# EAGLE design PIXIE_CHROMA_EVAL_PCB (EAGLE 9.5.1)
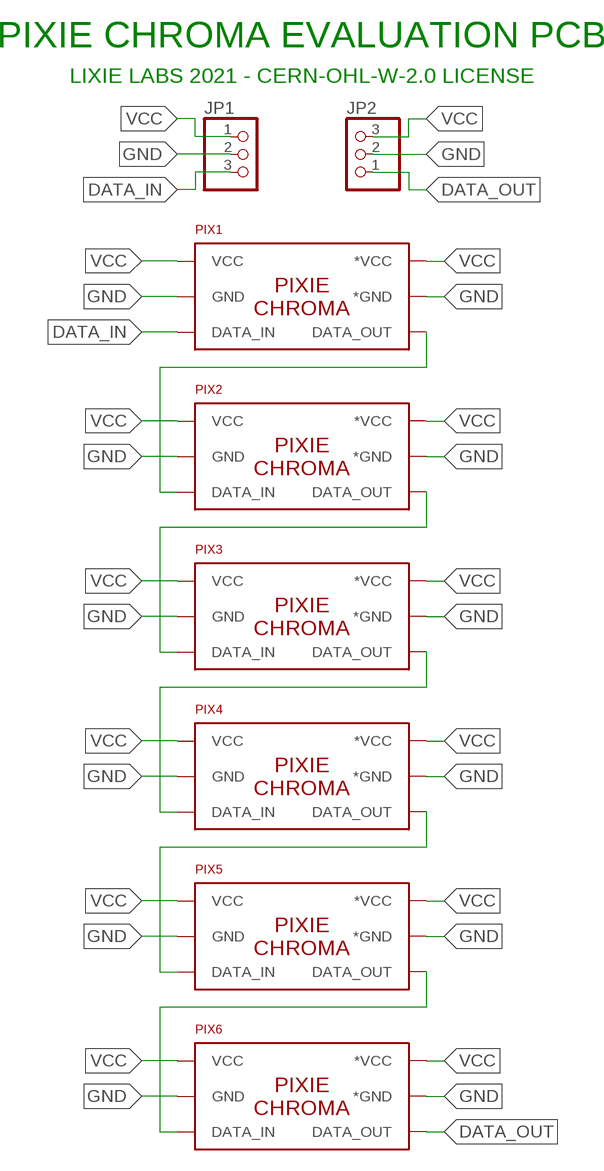
[diagram p0: schematic, sheet 1]

## Parts
JP1  PINHD-1X3  [1X03]
JP2  PINHD-1X3  [1X03]
PIX1  CHROMA  [CHROMA]
PIX2  CHROMA  [CHROMA]
PIX3  CHROMA  [CHROMA]
PIX4  CHROMA  [CHROMA]
PIX5  CHROMA  [CHROMA]
PIX6  CHROMA  [CHROMA]

## Nets
DATA_IN: JP1.3 PIX1.DATA_IN
DATA_OUT: JP2.1 PIX6.DATA_OUT
GND: JP1.2 JP2.2 PIX1.*GND PIX1.GND PIX2.*GND PIX2.GND PIX3.*GND PIX3.GND PIX4.*GND PIX4.GND PIX5.*GND PIX5.GND PIX6.*GND PIX6.GND
N$1: PIX1.DATA_OUT PIX2.DATA_IN
N$2: PIX2.DATA_OUT PIX3.DATA_IN
N$3: PIX3.DATA_OUT PIX4.DATA_IN
N$4: PIX4.DATA_OUT PIX5.DATA_IN
N$5: PIX5.DATA_OUT PIX6.DATA_IN
VCC: JP1.1 JP2.3 PIX1.*VCC PIX1.VCC PIX2.*VCC PIX2.VCC PIX3.*VCC PIX3.VCC PIX4.*VCC PIX4.VCC PIX5.*VCC PIX5.VCC PIX6.*VCC PIX6.VCC

## Notes on the sheet
- PIXIE CHROMA EVALUATION PCB
- LIXIE LABS 2021 - CERN-OHL-W-2.0 LICENSE

## Library data of the parts
JP1 JP2 = pinhead:PINHD-1X3: PIN HEADER
PIX1-PIX6 = PixieChroma:CHROMA: PIXIE CHROMA (R1) by LIXIE LABS (c) 2021 - CERN-OHL-W-2.0 LICENSE

## Board
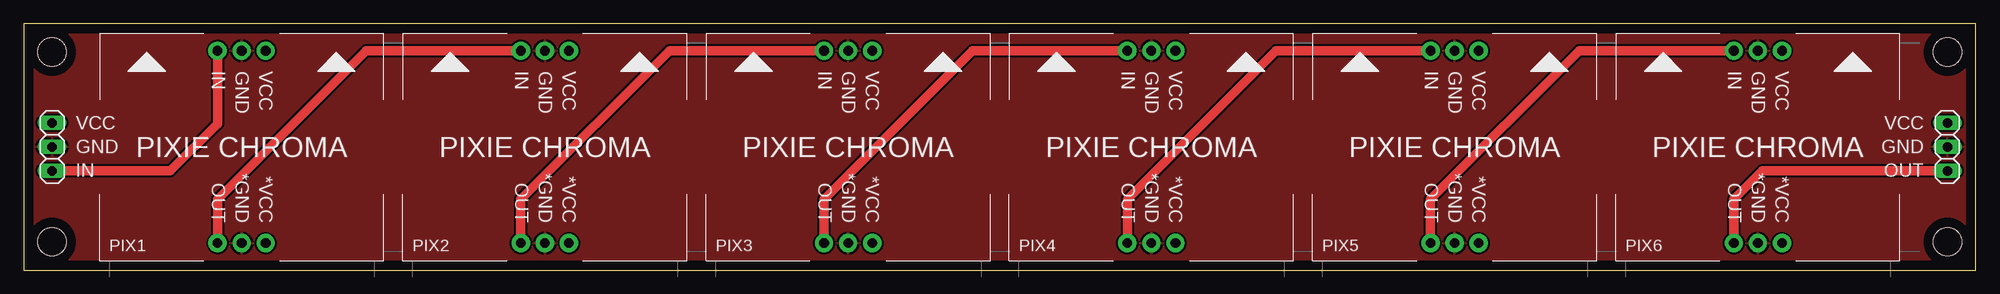
[diagram p1: board, top side]
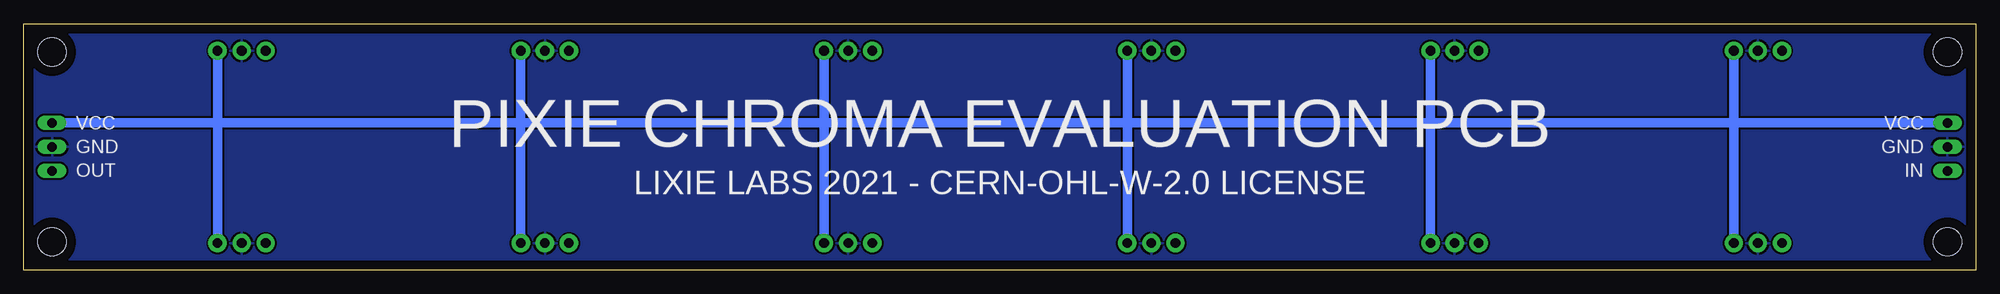
[diagram p2: board, bottom side, seen from below]

Size 206 x 26 mm. Coordinates in mm from the lower left corner, seen from the top.
Outline: 0,0 206,0 206,26 0,26 0,0
Copper layers (1*16): Top 0.035mm / dielectric 1.5mm / Bottom 0.035mm
Design rules "PCBway": minimum track width 6mil, minimum drill 0.3mm, track to track 0.205mm, track to pad 0.205mm, pad to pad 0.205mm, via to via 0.205mm, smd to smd 8mil, copper to edge 40mil, drill to drill 8mil, minimum pad ring 10mil, minimum via ring 8mil, stop-mask expansion 4mil, vias tented up to drill 25mil, thermal gap 10mil
Holes 3 mm at 3,23 3,3 203,23 203,3

### Footprints (pad centres in the part's own frame; a part is rotated, then mirrored left to right if it is on the bottom)
1X03 = drill 1.016 long: 1 -2.54,0; 2 0,0; 3 2.54,0
CHROMA = drill 1.02 pad 1.93: *GND 0,-10.15; *VCC 2.54,-10.15; DATA_IN -2.54,10.15; DATA_OUT -2.54,-10.15; GND 0,10.15; VCC 2.54,10.15

### Placement (x,y rotation side)
JP1  3,13 270 top
JP2  203,13 90 top
PIX1  23,13 0 top
PIX2  55,13 0 top
PIX3  87,13 0 top
PIX4  119,13 0 top
PIX5  151,13 0 top
PIX6  183,13 0 top

### Tracks (layer width: path | path; a pad name or v marks a point on that pad's centre or on a via)
DATA_IN
  Top 1.016: PIX1.DATA_IN 20.46,15.46 15.46,10.46 JP1.3
DATA_OUT
  Top 1.016: PIX6.DATA_OUT 180.46,7.46 183.46,10.46 JP2.1
GND
  pour Top: -1,27 -1,-1 207,-1 207,27
  pour Bottom: -1,27 207,27 207,-1 -1,-1
N$1
  Top 1.016: PIX1.DATA_OUT 20.46,7.46 36.15,23.15 PIX2.DATA_IN
N$2
  Top 1.016: PIX2.DATA_OUT 52.46,7.46 68.15,23.15 PIX3.DATA_IN
N$3
  Top 1.016: PIX3.DATA_OUT 84.46,7.46 100.15,23.15 PIX4.DATA_IN
N$4
  Top 1.016: PIX4.DATA_OUT 116.46,7.46 132.15,23.15 PIX5.DATA_IN
N$5
  Top 1.016: PIX5.DATA_OUT 148.46,7.46 164.15,23.15 PIX6.DATA_IN
VCC
  Bottom 1.016: JP1.1 25.54,15.54 | 25.54,15.54 57.54,15.54 | 57.54,15.54 89.54,15.54 | 89.54,15.54 121.54,15.54 | 121.54,15.54 153.54,15.54 | 153.54,15.54 185.54,15.54 | 185.54,15.54 JP2.3 | PIX1.VCC 25.54,15.54 | PIX2.VCC 57.54,15.54 | PIX3.VCC 89.54,15.54 | PIX4.VCC 121.54,15.54 | PIX5.VCC 153.54,15.54 | PIX6.VCC 185.54,15.54 | PIX1.*VCC 25.54,15.54 | PIX2.*VCC 57.54,15.54 | PIX3.*VCC 89.54,15.54 | PIX4.*VCC 121.54,15.54 | PIX5.*VCC 153.54,15.54 | PIX6.*VCC 185.54,15.54

### Text on the board
tNames: VCC | VCC | GND | GND | IN | OUT
bNames: VCC | VCC | GND | PIXIE CHROMA EVALUATION PCB | GND | IN | OUT | LIXIE LABS 2021 - CERN-OHL-W-2.0 LICENSE
tDocu: PIXIE CHROMA EVALUATION PCB | LIXIE LABS 2021 - CERN-OHL-W-2.0 LICENSE